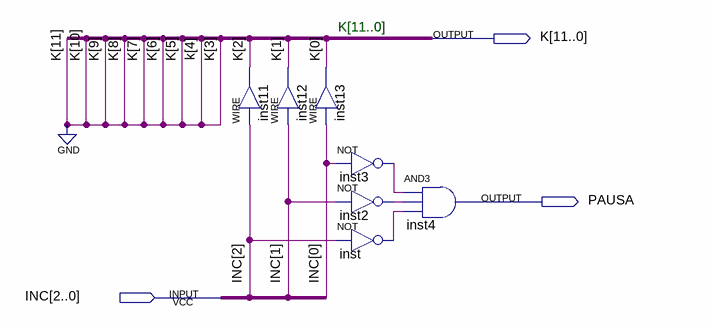
[diagram p0: schematic sheet]
// Quartus schematic K_Pausa.bdf as structural Verilog: 7 symbols, 3 pins
module K_Pausa (
  input  [2:0] INC,
  output [11:0] K,
  output PAUSA
);

  wire inst2_out, inst3_out, inst_out;

  assign K[2] = INC[2];  // WIRE inst11
  assign K[1] = INC[1];  // WIRE inst12
  assign K[0] = INC[0];  // WIRE inst13
  not inst3 (inst3_out, INC[0]);
  not inst2 (inst2_out, INC[1]);
  not inst (inst_out, INC[2]);
  and inst4 (PAUSA, inst3_out, inst2_out, inst_out);

  assign K[11:3] = {9{1'b0}};

  // Notes on the sheet:
  //   K[11..0]
endmodule
